# Altium schematic sheet [8]_MOT_CONNECTOR.SchDoc
size A3; DocumentNumber: 8; SheetNumber: 8; SheetTotal: 12; Ngu?i ki?m tra: bangdd; Ngu?i thi?t k?: thannt114
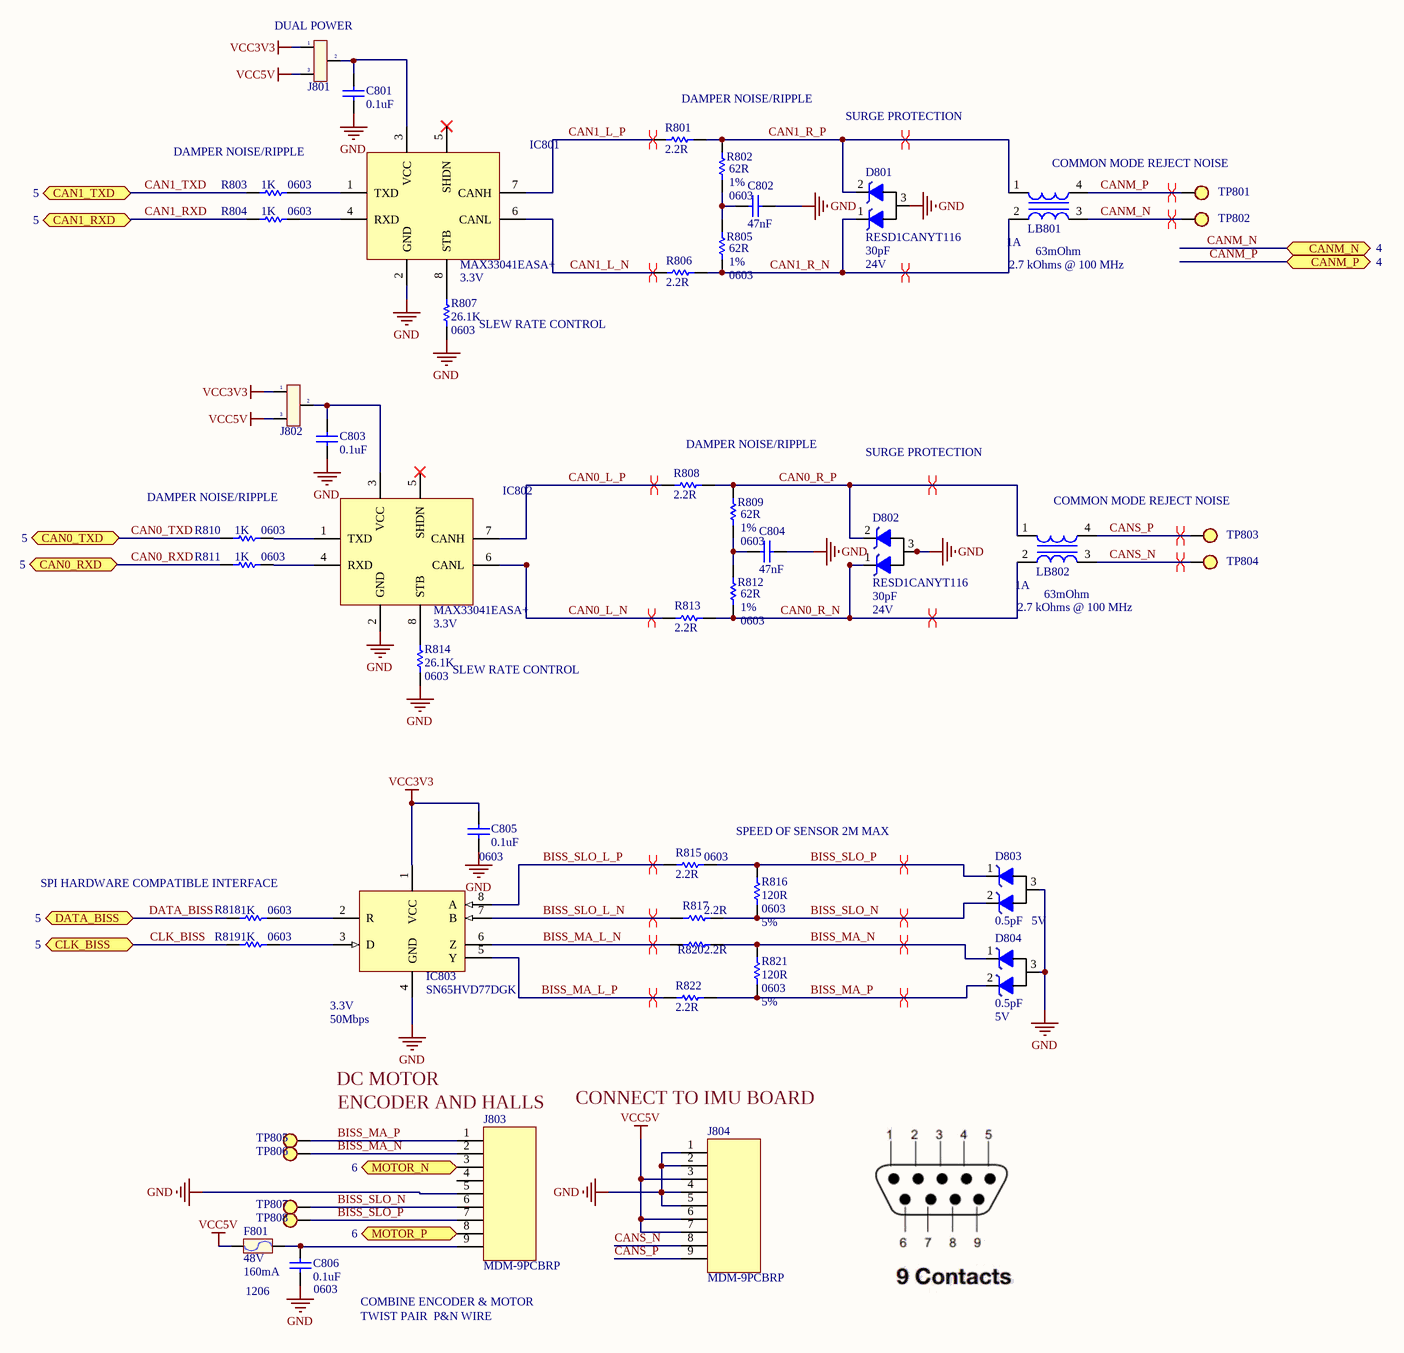
[diagram p0: [8]_MOT_CONNECTOR.SchDoc]

## Parts
C801  0.1uF  [CAP 0603]
C802  47nF  [CAP 0603]
C803  0.1uF  [CAP 0603]
C804  47nF  [CAP 0603]
C805  FOOTPRINT: 0603  [CAP 0603]  (hidden comment: 0.1uF)
C806  FOOTPRINT: 0603  [CAP 0603]  (hidden comment: 0.1uF)
D801  CAPACITANCE: 30pF  VOLTAGE: 24V  [SOT-23-3]  (hidden comment: RESD1CANYT116)
D802  CAPACITANCE: 30pF  VOLTAGE: 24V  [SOT-23-3]  (hidden comment: RESD1CANYT116)
D803  CAPACITANCE: 0.5pF  VOLTAGE: 5V  [SOT-416]  (hidden comment: ESDR0502BT1G)
D804  CAPACITANCE: 0.5pF  VOLTAGE: 5V  [SOT-416]  (hidden comment: ESDR0502BT1G)
F801  Voltage - Rated: 48V  Package / Case: 1206  Current Rating (Amps): 160mA  [RES 1206]  (hidden comment: 0ZCG0014FF2C)
IC801  VOLTAGE: 3.3V  [8-SOIC]  (hidden comment: MAX33041EASA+)
IC802  VOLTAGE: 3.3V  [8-SOIC]  (hidden comment: MAX33041EASA+)
IC803  Manufacturer Part Number: SN65HVD77DGK  VOLTAGE: 3.3V  SPEED: 50Mbps  [8-VSSOP]  (hidden comment: IC;IC TRANSCEIVER FULL 1/1 8SOIC,8-SOIC,-40TO 85°C,SN65HVD77DR)
J801  JP 2-1  [JP3]  (value not drawn)
J802  JP 2-1  [JP3]  (value not drawn)
J803  CONN-DIP;CONN MICRO-D PLUG 9POS R/A SLDR,M,MDM-9PCBRP  [MDM-9PCBRP]  (value not drawn)
J804  CONN-DIP;CONN MICRO-D PLUG 9POS R/A SLDR,M,MDM-9PCBRP  [MDM-9PCBRP]  (value not drawn)
LB801  CURRENT: 1A  IMPEDANCE: 2.7 kOhms @ 100 MHz  DCR: 63mOhm  [MCM-7060M]  (hidden comment: MCM-7060M-272-RU)
LB802  CURRENT: 1A  IMPEDANCE: 2.7 kOhms @ 100 MHz  DCR: 63mOhm  [MCM-7060M]  (hidden comment: MCM-7060M-272-RU)
R801  2.2R  [res 0603]
R802  TOLERANCE: 1%  PACKAGE: 0603  [R0603]  (hidden comment: 62R)
R803  PCB Footprint: 0603  [res 0603]  (hidden comment: 1K)
R804  PCB Footprint: 0603  [res 0603]  (hidden comment: 1K)
R805  TOLERANCE: 1%  PACKAGE: 0603  [R0603]  (hidden comment: 62R)
R806  2.2R  [res 0603]
R807  PCB Footprint: 0603  [R0603]  (hidden comment: 26.1K)
R808  2.2R  [res 0603]
R809  TOLERANCE: 1%  PACKAGE: 0603  [R0603]  (hidden comment: 62R)
R810  PCB Footprint: 0603  [res 0603]  (hidden comment: 1K)
R811  PCB Footprint: 0603  [res 0603]  (hidden comment: 1K)
R812  TOLERANCE: 1%  PACKAGE: 0603  [R0603]  (hidden comment: 62R)
R813  2.2R  [res 0603]
R814  PCB Footprint: 0603  [R0603]  (hidden comment: 26.1K)
R815  PCB Footprint: 0603  [res 0603]  (hidden comment: 2.2R)
R816  PCB_ Footprint: 0603  Tolerance: 5%  [res 0603]  (hidden comment: 120R)
R817  2.2R  [res 0603]
R818  PCB Footprint: 0603  [res 0603]  (hidden comment: 1K)
R819  PCB Footprint: 0603  [res 0603]  (hidden comment: 1K)
R820  2.2R  [res 0603]
R821  PCB_ Footprint: 0603  Tolerance: 5%  [res 0603]  (hidden comment: 120R)
R822  2.2R  [res 0603]
TP801  TP SMD  [TESTPOINT]  (value not drawn)  (no BOM)
TP802  TP SMD  [TESTPOINT]  (value not drawn)  (no BOM)
TP803  TP SMD  [TESTPOINT]  (value not drawn)  (no BOM)
TP804  TP SMD  [TESTPOINT]  (value not drawn)  (no BOM)
TP805  TP SMD  [TESTPOINT]  (value not drawn)  (no BOM)
TP806  TP SMD  [TESTPOINT]  (value not drawn)  (no BOM)
TP807  TP SMD  [TESTPOINT]  (value not drawn)  (no BOM)
TP808  TP SMD  [TESTPOINT]  (value not drawn)  (no BOM)

## Ports
CAN0_RXD (bidir, see 5), CAN0_TXD (bidir, see 5), CAN1_RXD (bidir, see 5), CAN1_TXD (bidir, see 5), CANM_N (bidir, see 4), CANM_P (bidir, see 4), CLK_BISS (bidir, see 5), DATA_BISS (bidir, see 5), MOTOR_N (bidir, see 6), MOTOR_P (bidir, see 6)

## Nets
GND: C801.2 C802.2 C803.2 C804.2 C805.2 C806.2 D801.3(A) D802.3(A) D803.3(A) D804.3(A) IC801.2(GND) IC802.2(GND) IC803.4(GND) J803.5 J804.1 J804.2 J804.4 J804.5 R807.2 R814.2
VCC3V3: C805.1 IC803.1(VCC) J801.1 J802.1
VCC5V: F801.2 J801.3 J802.3 J804.3 J804.6 J804.7
BISS_MA_L_N: IC803.6(Z) R820.2
BISS_MA_L_P: IC803.5(Y) R822.2
BISS_MA_N: D804.1(K) J803.2 R820.1 R821.1 TP806.1
BISS_MA_P: D804.2(K) J803.1 R821.2 R822.1 TP805.1
BISS_SLO_L_N: IC803.7(B) R817.2
BISS_SLO_L_P: IC803.8(A) R815.2
BISS_SLO_N: D803.2(K) J803.6 R816.2 R817.1 TP807.1
BISS_SLO_P: D803.1(K) J803.7 R815.1 R816.1 TP808.1
CAN0_L_N: IC802.6(CANL) R813.2
CAN0_L_P: IC802.7(CANH) R808.2
CAN0_R_N: D802.1(K) LB802.2 R812.1 R813.1
CAN0_R_P: D802.2(K) LB802.1 R808.1 R809.2
CAN0_RXD: R811.2 ; port CAN0_RXD
CAN0_TXD: R810.2 ; port CAN0_TXD
CAN1_L_N: IC801.6(CANL) R806.2
CAN1_L_P: IC801.7(CANH) R801.2
CAN1_R_N: D801.1(K) LB801.2 R805.1 R806.1
CAN1_R_P: D801.2(K) LB801.1 R801.1 R802.2
CAN1_RXD: R804.2 ; port CAN1_RXD
CAN1_TXD: R803.2 ; port CAN1_TXD
CANM_N: LB801.3 TP802.1 ; port CANM_N
CANM_P: LB801.4 TP801.1 ; port CANM_P
CANS_N: J804.8 LB802.3 TP804.1
CANS_P: J804.9 LB802.4 TP803.1
CLK_BISS: R819.2 ; port CLK_BISS
DATA_BISS: R818.2 ; port DATA_BISS
MOTOR_N: J803.3 ; port MOTOR_N
MOTOR_P: J803.8 ; port MOTOR_P
NetC801_1: C801.1 IC801.3(VCC) J801.2
NetC802_1: C802.1 R802.1 R805.2
NetC803_1: C803.1 IC802.3(VCC) J802.2
NetC804_1: C804.1 R809.1 R812.2
NetC806_1: C806.1 F801.1 J803.9
NetIC801_1: IC801.1(TXD) R803.1
NetIC801_4: IC801.4(RXD) R804.1
NetIC801_8: IC801.8(STB) R807.1
NetIC802_1: IC802.1(TXD) R810.1
NetIC802_4: IC802.4(RXD) R811.1
NetIC802_8: IC802.8(STB) R814.1
NetIC803_2: IC803.2(R) R818.1
NetIC803_3: IC803.3(D) R819.1

Not connected (* = marked no-connect by the designer): IC801 5(SHDN)*; IC802 5(SHDN)*; J803 4

## Layout directives
differential pair: BISS_MA_L_N, BISS_MA_L_P, BISS_MA_N, BISS_MA_P, BISS_SLO_L_N, BISS_SLO_L_P, BISS_SLO_N, BISS_SLO_P, CAN0_L_N, CAN0_L_P, CAN0_R_N, CAN0_R_P, CAN1_L_N, CAN1_L_P, CAN1_R_N, CAN1_R_P, CANM_N, CANM_P, CANS_N, CANS_P

## Notes on the sheet
- (near J801) DUAL POWER
- DAMPER NOISE/RIPPLE
- SURGE PROTECTION
- (near R803) DAMPER NOISE/RIPPLE
- COMMON MODE REJECT NOISE
- (near R807) SLEW RATE CONTROL
- (near R810) DAMPER NOISE/RIPPLE
- (near R814) SLEW RATE CONTROL
- SPEED OF SENSOR 2M MAX
- (near R818) SPI HARDWARE COMPATIBLE INTERFACE
- DC MOTOR
- (near J803) ENCODER AND HALLS
- (near J804) CONNECT TO IMU BOARD
- COMBINE ENCODER & MOTOR
- TWIST PAIR  P&N WIRE

## Library data of the parts
C801 C803 = Cap: CAP-CER,SMD;0.1UF,10%,50V,X7R,0603; MANUFACTURER1: Samsung Electro-Mechanics; MANUFACTURER1_PART#: CL10B104KB8NNNC; MANUFACTURER2_PART#: M0603X104K050TAX; MANUFACTURER1: SS; Unit: PCS; PACKING: Tape & Reel (TR); PCB FOOTPRINT: 0603; Process Type: SM; CATEGORY: CAP-CER; VALUE: 0.1uF; FOOTPRINT: 0603; Material: X7R; Voltage: 50V; Tolerance: ±10%; MANUFACTURER2: UWA
C802 C804 = Cap: CAP-CER,SMD; 47nF,10%,50V,X7R,0603; MANUFACTURER1: Meritek; MANUFACTURER1_PART#: MA0603XR473K500; MANUFACTURER2_PART#: C0603X7R500-473KNE; Unit: PCS; PACKING: Tape & Reel (TR); PCB FOOTPRINT: 0603; Process Type: SM; CATEGORY: CAP-CER; VALUE: 47nF; FOOTPRINT: 0603; Material: X7R; Voltage: 50V; Tolerance: ±10%; MANUFACTURER2: Venkel
C805 C806 = Cap: CAP-CER,SMD;0.1UF,10%,50V,X7R,0603; MANUFACTURER1: Samsung Electro-Mechanics; MANUFACTURER1_PART#: CL10B104KB8NNNC; MANUFACTURER2_PART#: M0603X104K050TAX; MANUFACTURER1: SS; Unit: PCS; PACKING: Tape & Reel (TR); Process Type: SM; CATEGORY: CAP-CER; VALUE: 0.1uF; Material: X7R; Voltage: 50V; PCB FOOTPRINT: 0603; Tolerance: ±10%; MANUFACTURER2: UWA
D801 D802 = TVS_DUAL_SIGNAL_5V_SOT23: TVS DIODE 24VWM 50VC SOT23-; MANUFACTURER1: Littelfuse; CURRENT: 10A; POWER: 230W; Category: TVS; MANUFACTURER1_PART#: RESD1CANYT116; Value: RESD1CANYT116; LOH_CODE: *; LINK: https://www.digikey.com/en/products/detail/littelfuse-inc/SM24CANB-02HTG/5048174?s=N4IgTCBcDaIMoFkwBYDCBBAcgIQLQAYwAJAFQHEQBdAXyA; PRICE: 0.78000
D803 D804 = TVS_DUAL_SIGNAL_5V_SOT23: 5V, ESD PROTECTION DEVICES, SOT-23; MANUFACTURER2_PART#: DF3D6.8MS,LF; MANUFACTURER1: ON Semiconductor; CURRENT: 1A; POWER: 320W; Category: TVS; MANUFACTURER1_PART#: ESDR0502BT1G; MANUFACTURER2: Toshiba; Value: ESDR0502BT1G; LOH_CODE: *
F801 = 0875.800MXEP: PTC RESET FUSE 48V 160MA 1206; MANUFACTURER1_PART#: 0ZCJ0016FF2E; MANUFACTURER2_PART#: CLA1684; MANUFACTURER1: Bel Fuse; PROCESS_TYPE: SM; Unit: PCS; Response Time: 8ms; Breaking Capacity @ Rated Voltage: 10A; DC Cold Resistance: 1.1 Ohms; CATEGORY: FUSE; MANUFACTURER2: https://linhkienchatluong.vn/cau-chi-tu-phuc-hoi-ptc/cau-chi-tu-phuc-hoi-1206-01a-60v-ptc-smd_sp845_ct4084.aspx; Value: 0ZCG0014FF2C
IC801 IC802 = IC;IC CAN TRANSEIVER HS,8SOIC,-40TO150°C,TJA1042T/3,118: IC CAN TXRX 3.3V 2MBPS SOIC; MANUFACTURER1: Maxim; Manufacturer Part Number: MAX33041EASA+; VALUE: MAX33041EASA+; Category: IC; MANUFACTURER1_PART#: MAX33041EASA+; LINK: https://www.digikey.com/en/products/detail/maxim-integrated/MAX33041EASA/15286828; PRICE: 3.5700
IC803 = IC;IC TRANSCEIVER FULL 1/1 8SOIC,8-SOIC,-40TO 85°C,SN65HVD77DR: IC TRANSCEIVER FULL 1/1 8VSSOP; Manufacturer: TI; MANUFACTURER1: Texas Instruments; VALUE: SN65HVD77DGK; Category: IC; LINK: https://www.digikey.com/en/products/detail/texas-instruments/SN65HVD77DR/4965743; PRICE: 3.623; MANUFACTURER1_PART#: SN65HVD77DGK
J801 J802 = JP 2-1: Jumper 2-1; Value: J2-1
J803 J804 = CONN-DIP;CONN MICRO-D PLUG 9POS R/A SLDR,M,MDM-9PCBRP: CONN MICRO-D PLUG 9POS R/A SLDR; Manufacturer: ITT CANNON, LLC; Manufacturer Part Number: MDM-9PCBRP; MANUFACTURER1: ITT CANNON, LLC; MANUFACTURER1_PART#: MDM-9PCBRP
  J803: Category: CONN
  J804: CATEGORY: CONN
LB801 LB802 = CHOKE-SMD;90OHM@100MHz,0.15A,5V,DLP11SA900HL2L: CMC 1A 2LN 2.7KOHM SMD; MANUFACTURER1: Mag Layers; VALUE: MCM-7060M-272-RU; LINK: https://www.digikey.com/en/products/detail/mag-layers/MCM-7060M-272-RU/13910475; MANUFACTURER1_PART#: MCM-7060M-272-RU; NI_MARK: *; MANUFACTURER2_PART#: *; MANUFACTURER2: *; Category: CHOKE; PRICE: 0.60000; PACKAGE: (7.50mm x 6.00mm)
R801 R806 R808 R813 R817 R820 R822 = Res0.3: RES SMD 2.2 OHM 5% 1/10W 0603; MANUFACTURER1: Yageo; MANUFACTURER1_PART#: RC0603JR-072R2L; MANUFACTURER2_PART#: RMCF0603JT2R20; PACKING: Tape & Reel (TR); PCB Footprint: 0603; Process Type: SM; Unit: PCS; Power: 0.25W; Value: 2.2R; CATEGORY: RES-SMD; MANUFACTURER2: Stackpole Electronics Inc; Tolerance: ±5%
R802 R805 R809 R812 = RES-SMD;60.4OHM,1%,0402,1/10W: RES SM 62 OHM 1% 1/10W 0603; MANUFACTURER1: Stackpole; MANUFACTURER1_PART#: RMCF0603FT62R0; MANUFACTURER2_PART#: RC0603FR-0762RL; VALUE: 62R; Category: RES-SMD; MANUFACTURER2: YAGEO
R803 R804 R810 R811 R818 R819 = Res0.3: RES SMD,1K OHM,5%,1/10W,0603; MANUFACTURER1: Stackpole Electronics Inc; MANUFACTURER1_PART#: RMCF06031K00JNEAC; MANUFACTURER2_PART#: R0603J1KTG; DESCCRIPTION: RES SMD 1K OHM 5% 1/10W 0603; PACKING: Tape & Reel (TR); Process Type: SM; Unit: PCS; LOH_Code: 140100083; Power: 0.25W; Value: 1K; CATEGORY: RES SMD; MANUFACTURER2: UWA; Tolerance: ±5%
R807 R814 = Res0.3: RES 26.1K OHM 1% 1/10W 0603; MANUFACTURER1: Stackpole Electronics Inc; MANUFACTURER1_PART#: RMCF0603FT26K1; MANUFACTURER2_PART#: RC0603FR-0726K1L; PACKING: Tape & Reel (TR); Process Type: SM; Unit: PCS; Power: 0.25W; Value: 26.1K; CATEGORY: RES-SMD; MANUFACTURER2: YAGEO; Tolerance: ±1%
R815 = Res0.3: RES SMD 2.2 OHM 5% 1/10W 0603; MANUFACTURER1: Yageo; MANUFACTURER1_PART#: RC0603JR-072R2L; MANUFACTURER2_PART#: RMCF0603JT2R20; PACKING: Tape & Reel (TR); Process Type: SM; Unit: PCS; Power: 0.25W; Value: 2.2R; CATEGORY: RES-SMD; MANUFACTURER2: Stackpole Electronics Inc; Tolerance: ±5%
R816 R821 = RES 120 OHM 5% 1/10W 0603: MANUFACTURER1: Stackpole; MANUFACTURER1_PART#: RMCF0603JG120R; PROC: SM; Unit: PCS; CATEGORY: RES-SMD; VALUE: 120R; FOOTPRINT: 0603
TP801-TP808 = TP SMD: TEST POINT